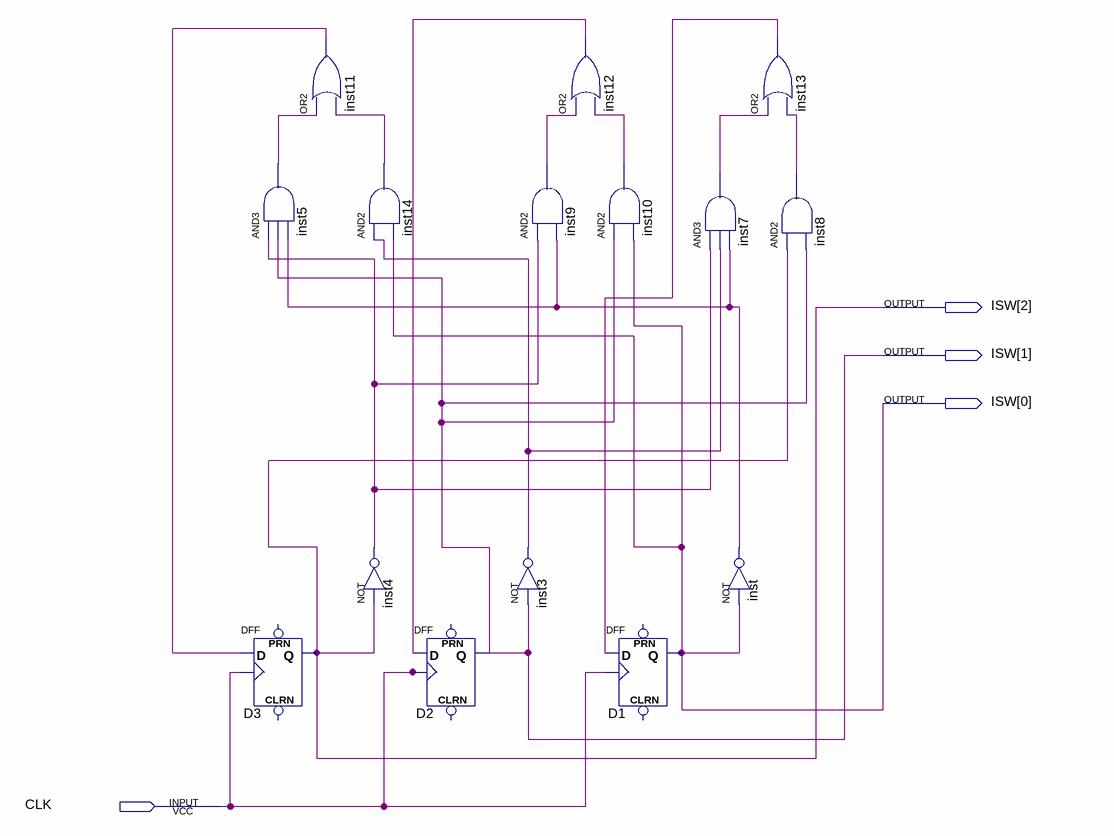
[diagram p0: schematic sheet]
// Quartus schematic lab2-d.bdf as structural Verilog: 15 symbols, 4 pins
module \lab2-d  (
  input  CLK,
  output [2:0] ISW
);

  wire inst3_out, inst4_out, inst5_out, inst7_out, inst8_out, inst9_out, inst10_out, inst11_out, inst12_out,
       inst13_out, inst14_out, inst_out;

  and inst5 (inst5_out, inst4_out, ISW[1], inst_out);
  DFF D3 (.CLK(CLK), .D(inst11_out), .Q(ISW[2]));  // open: CLRN, PRN
  or inst11 (inst11_out, inst5_out, inst14_out);
  and inst14 (inst14_out, inst3_out, ISW[0]);
  not inst4 (inst4_out, ISW[2]);
  DFF D2 (.CLK(CLK), .D(inst12_out), .Q(ISW[1]));  // open: CLRN, PRN
  and inst9 (inst9_out, inst4_out, inst_out);
  not inst3 (inst3_out, ISW[1]);
  or inst12 (inst12_out, inst9_out, inst10_out);
  and inst10 (inst10_out, ISW[1], ISW[0]);
  DFF D1 (.CLK(CLK), .D(inst13_out), .Q(ISW[0]));  // open: CLRN, PRN
  or inst13 (inst13_out, inst7_out, inst8_out);
  and inst7 (inst7_out, inst4_out, inst3_out, inst_out);
  not inst (inst_out, ISW[0]);
  and inst8 (inst8_out, ISW[2], ISW[1]);
endmodule
